# Altium schematic sheet pca63100_current_automatic_switch.SchDoc: Power Profiler Kit II
size A3; Organization: Nordic Semiconductor; Revision: 1.0.1; SheetNumber: 5; SheetTotal: 6; CompanyName: Nordic Semiconductor; DocumentSize: A3
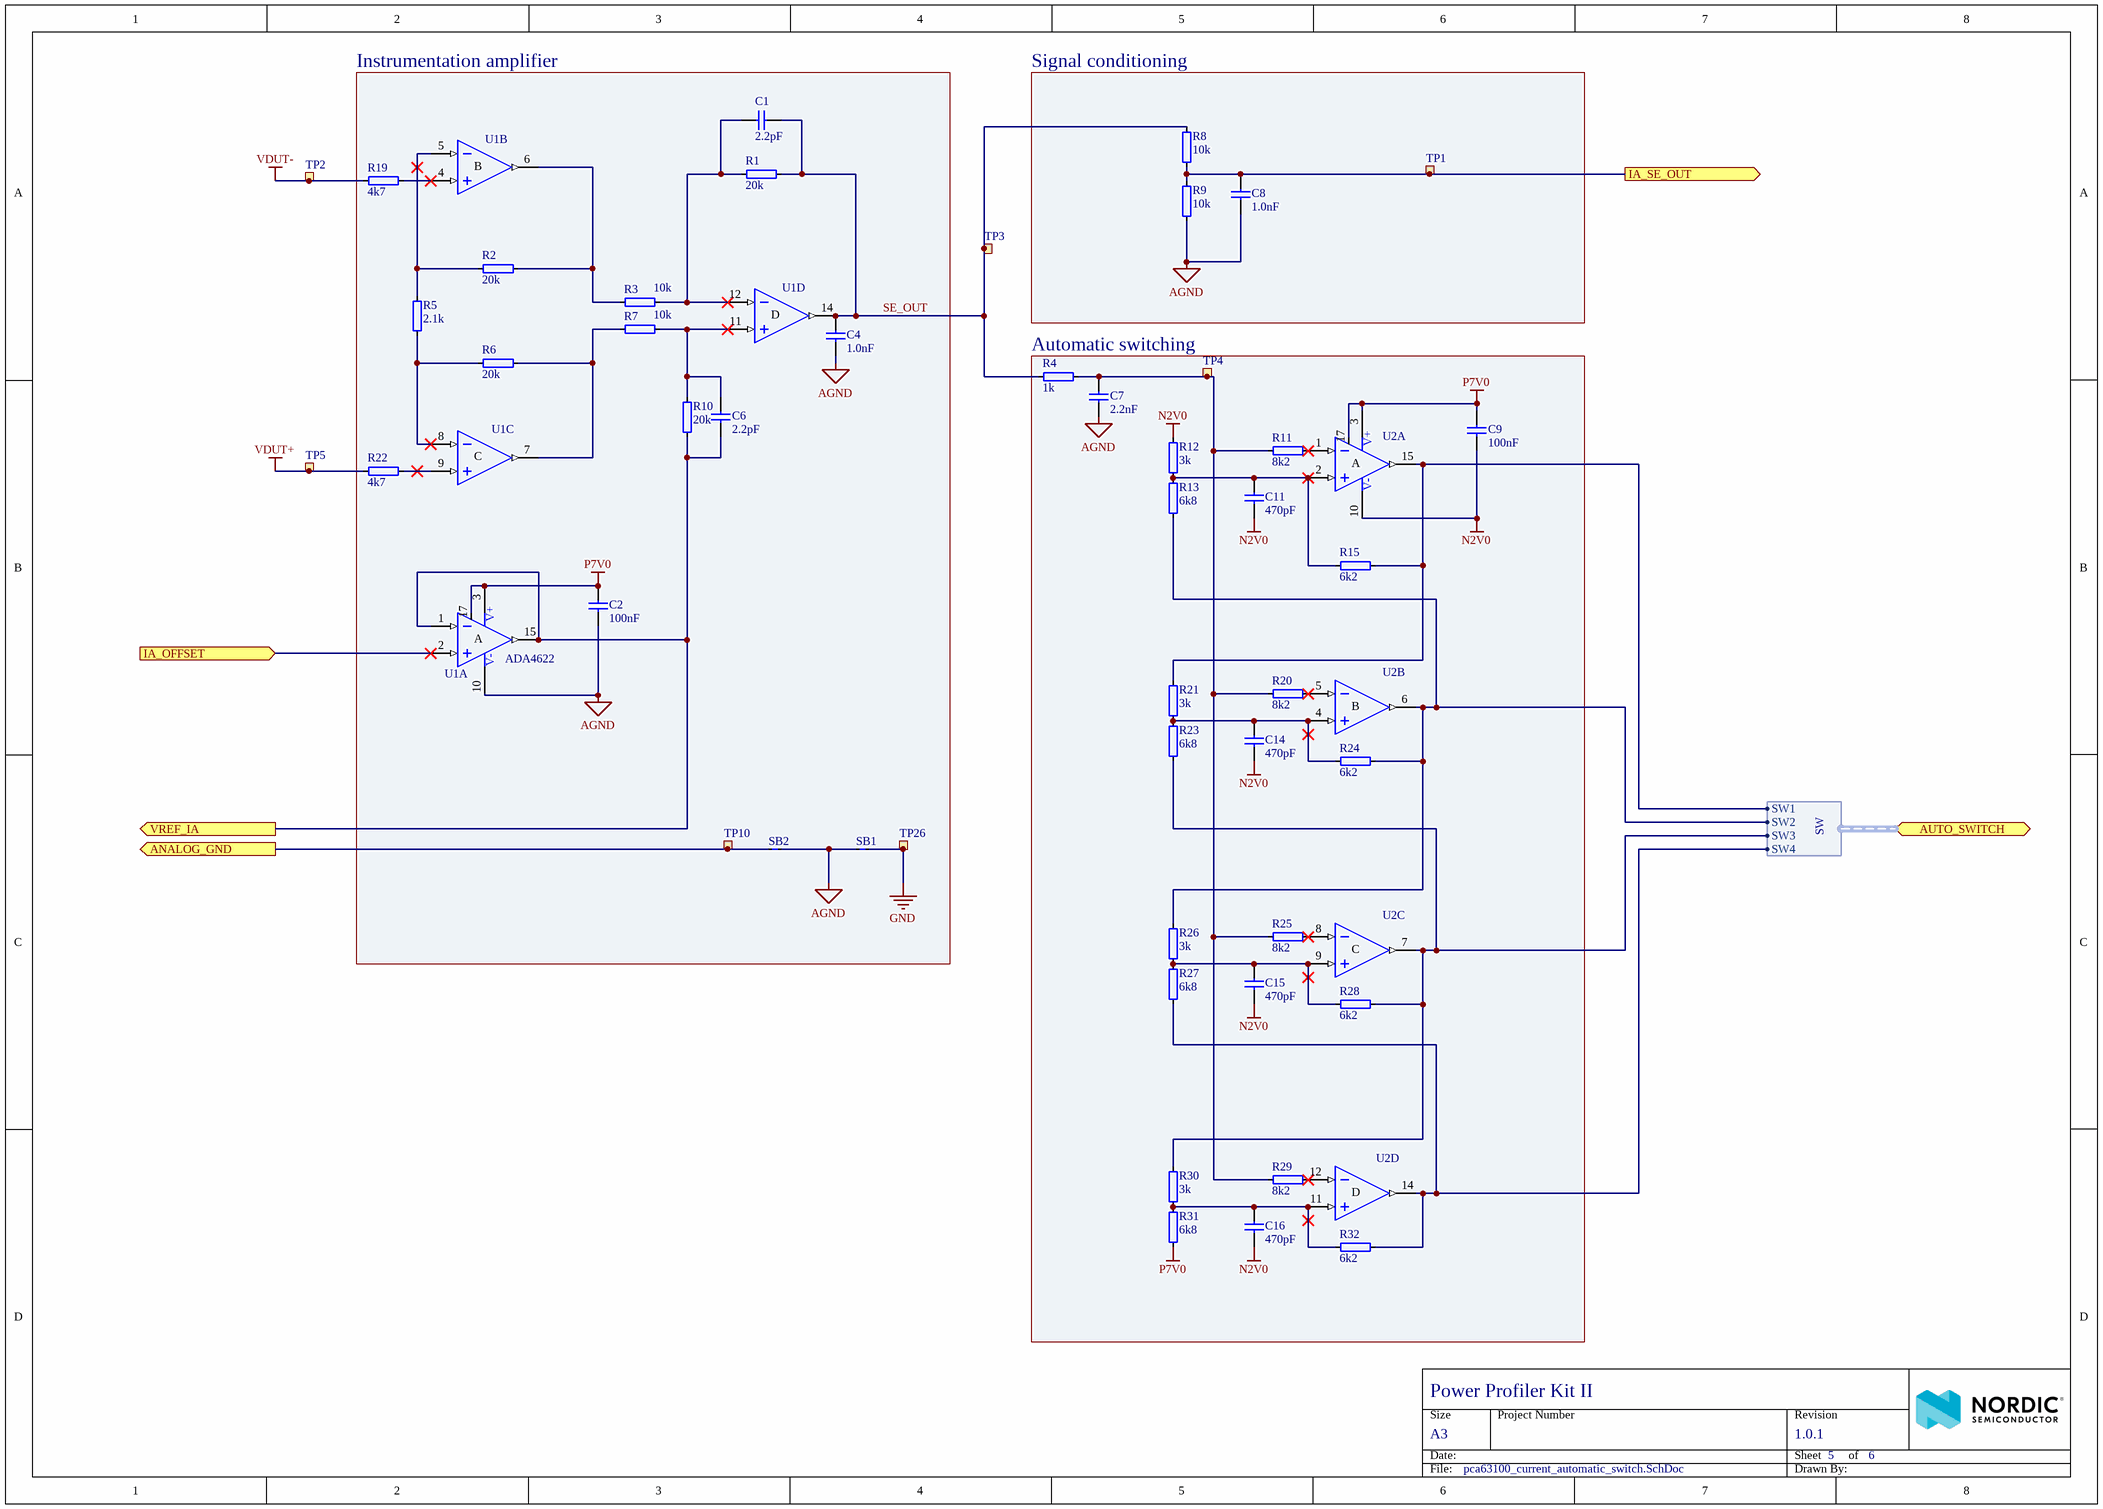
[diagram p0: pca63100_current_automatic_switch.SchDoc]

## Parts
C1  2.2pF  [CAPC0603X03L_C]
C2  100nF  [CAPC0603X03L_C]
C4  1.0nF  [CAPC0603X03L_C]
C6  2.2pF  [CAPC0603X03L_C]
C7  2.2nF  [CAPC0603X03L_C]
C8  1.0nF  [CAPC0603X03L_C]
C9  100nF  [CAPC0603X03L_C]
C11  470pF  [CAPC0603X03L_C]
C14  470pF  [CAPC0603X03L_C]
C15  470pF  [CAPC0603X03L_C]
C16  470pF  [CAPC0603X03L_C]
R1  20k  [RESC0603X03L_C]
R2  20k  [RESC0603X03L_C]
R3  10k  [RESC0603X03L_C]
R4  1k  [RESC0603X03L_C]
R5  2.1k  [RESC0603X03L_C]
R6  20k  [RESC0603X03L_C]
R7  10k  [RESC0603X03L_C]
R8  10k  [RESC0603X03L_C]
R9  10k  [RESC0603X03L_C]
R10  20k  [RESC0603X03L_C]
R11  8k2  [RESC0603X03L_C]
R12  3k  [RESC0603X03L_C]
R13  6k8  [RESC0603X03L_C]
R15  6k2  [RESC0603X03L_C]
R19  4k7  [RESC0603X03L_C]
R20  8k2  [RESC0603X03L_C]
R21  3k  [RESC0603X03L_C]
R22  4k7  [RESC0603X03L_C]
R23  6k8  [RESC0603X03L_C]
R24  6k2  [RESC0603X03L_C]
R25  8k2  [RESC0603X03L_C]
R26  3k  [RESC0603X03L_C]
R27  6k8  [RESC0603X03L_C]
R28  6k2  [RESC0603X03L_C]
R29  8k2  [RESC0603X03L_C]
R30  3k  [RESC0603X03L_C]
R31  6k8  [RESC0603X03L_C]
R32  6k2  [RESC0603X03L_C]
SB1  NetTie_200um  [NetTie_200um]  (value not drawn)  (net tie, no BOM)
SB2  NetTie_200um  [NetTie_200um]  (value not drawn)  (net tie, no BOM)
TP1  Ø0.7mm,SMD  [TP_SMD_Ø0.7mm]  (value not drawn)  (no BOM)
TP2  Ø0.7mm,SMD  [TP_SMD_Ø0.7mm]  (value not drawn)  (no BOM)
TP3  Ø0.7mm,SMD  [TP_SMD_Ø0.7mm]  (value not drawn)  (no BOM)
TP4  Ø0.7mm,SMD  [TP_SMD_Ø0.7mm]  (value not drawn)  (no BOM)
TP5  Ø0.7mm,SMD  [TP_SMD_Ø0.7mm]  (value not drawn)  (no BOM)
TP10  Ø0.7mm,SMD  [TP_SMD_Ø0.7mm]  (value not drawn)  (no BOM)
TP26  Ø0.7mm,SMD  [TP_SMD_Ø0.7mm]  (value not drawn)  (no BOM)
U1  ADA4622  [QFN65P400X400X80_HS-17N]  (parts A,B,C,D of 4)
U2  ADA4622  [QFN65P400X400X80_HS-17N]  (value not drawn)  (parts A,B,C,D of 4)

## Blocks framed on the sheet
Instrumentation amplifier: C1 C2 C4 C6 R1-R3 R5-R7 R10 R19 R22 SB1 SB2 TP10 TP26 U1
Signal conditioning: C8 R8 R9 TP1
Automatic switching: C7 C9 C11 C14-C16 R4 R11-R13 R15 R20 R21 R23-R32 TP4 U2

## Ports
ANALOG_GND (out), AUTO_SWITCH (bidir, harness SW), IA_OFFSET (in), IA_SE_OUT (out), VREF_IA (out)

## Harnesses
SW: SW1, SW2, SW3, SW4

## Nets
AGND: C2.2 C4.1 C7.1 C8.1 R9.1 SB1.1 SB2.2 U1.10(VSS)
GND: SB1.2 TP26.1
N2V0: C9.1 C11.1 C14.1 C15.1 C16.1 R12.2 U2.10(VSS)
P7V0: C2.1 C9.2 R31.1 U1.3(VDD) U1.17(EPAD) U2.3(VDD) U2.17(EPAD)
VDUT+: R22.2 TP5.1
VDUT-: R19.2 TP2.1
ANALOG_GND: SB2.1 TP10.1 ; port ANALOG_GND
IA_OFFSET: U1.2(IN_A+) ; port IA_OFFSET
IA_SE_OUT: C8.2 R8.2 R9.2 TP1.1 ; port IA_SE_OUT
SE_OUT: C1.2 C4.2 R1.2 R4.1 R8.1 TP3.1 U1.14(OUTD)
VREF_IA: C6.1 R10.1 U1.1(IN_A-) U1.15(OUTA) ; port VREF_IA
NetC1_1: C1.1 R1.1 R3.2 U1.12(IN_D-)
NetC6_2: C6.2 R7.2 R10.2 U1.11(IN_D+)
NetC7_2: C7.2 R4.2 R11.1 R20.1 R25.1 R29.1 TP4.1
NetC11_2: C11.2 R12.1 R13.2 R15.1 U2.2(IN_A+)
NetC14_2: C14.2 R21.1 R23.2 R24.1 U2.4(IN_B+)
NetC15_2: C15.2 R26.1 R27.2 R28.1 U2.9(IN_C+)
NetC16_2: C16.2 R30.1 R31.2 R32.1 U2.11(IN_D+)
NetR2_1: R2.1 R5.2 U1.5(IN_B-)
NetR2_2: R2.2 R3.1 U1.6(OUTB)
NetR5_1: R5.1 R6.1 U1.8(IN_C-)
NetR6_2: R6.2 R7.1 U1.7(OUTC)
NetR11_2: R11.2 U2.1(IN_A-)
NetR13_1: R13.1 R24.2 R26.2 U2.6(OUTB) ; port AUTO_SWITCH.SW2
NetR15_2: R15.2 R21.2 U2.15(OUTA) ; port AUTO_SWITCH.SW1
NetR19_1: R19.1 U1.4(IN_B+)
NetR20_2: R20.2 U2.5(IN_B-)
NetR22_1: R22.1 U1.9(IN_C+)
NetR23_1: R23.1 R28.2 R30.2 U2.7(OUTC) ; port AUTO_SWITCH.SW3
NetR25_2: R25.2 U2.8(IN_C-)
NetR27_1: R27.1 R32.2 U2.14(OUTD) ; port AUTO_SWITCH.SW4
NetR29_2: R29.2 U2.12(IN_D-)

Not connected (* = marked no-connect by the designer): U1 13(NIC) 16(NIC); U2 13(NIC) 16(NIC)

## Notes on the sheet
- Size
- Date:
- A3
- Project Number
- Sheet         of
- Revision
- File:
- Drawn By:
- (in symbol ADA4622-4, part A) V+; A; V-
- (in symbol ADA4622-4, part B) B
- (in symbol ADA4622-4, part C) C
- (in symbol ADA4622-4, part D) D

## Library data of the parts
C1 C6 = C0201-2.2p: Chip Cap 0201; Note: Chip Cap 1%; Artikkelnr Noca: N.A.; Pad Count: 2; Part Number: C0201-2.2p; ComponentLink1Description: Datasheet; ComponentLink2Description: Supplier link; Footprint Doc: 0201; LatestRevisionDate: 2014-11-13; Pin Count: 2; Publisher: Nordic Semiconductor; Published: 2014-11-13; Value: 2.2pF; Part number IPS: N.A.; Component Class: Capacitors; PartId: 100200020
C2 C9 = C0201-100n: Capacitor, X5R, ±10%; Part number IPS: 00000001248, 00000002505; Note: 16V; Artikkelnr Noca: N.A.; Pad Count: 2; Part Number: C0201-100n; Footprint Doc: 0201; LatestRevisionDate: 2017-11-09; Pin Count: 2; Publisher: Nordic Semiconductor; Published: 2014-11-13; Value: 100nF; ComponentLink1Description: Datasheet; ComponentLink2Description: Supplier link; Component Class: Capacitors; PartId: 100200078
C4 C8 = C0201-1n0: Capacitor, X7R, ±10%; Part number IPS: 00000003206; Note: 16V; Artikkelnr Noca: N.A.; Pad Count: 2; Part Number: C0201-1n0; ComponentLink1Description: Datasheet; ComponentLink2Description: Supplier link; Footprint Doc: 0201; LatestRevisionDate: 2020-10-13; Pin Count: 2; Publisher: Nordic Semiconductor; Published: 2014-11-13; Value: 1.0nF; Component Class: Capacitors; PartId: 100200056
C7 = C0201-2n2: Capacitor, X7R, ±10%, 10V; Part number IPS: 00000001778; Artikkelnr Noca: N.A.; Pad Count: 2; Part Number: C0201-2n2; ComponentLink1Description: Datasheet; ComponentLink2Description: Supplier link; Footprint Doc: 0201; LatestRevisionDate: 2014-11-13; Pin Count: 2; Publisher: Nordic Semiconductor; Published: 2014-11-13; Value: 2.2nF; Note: 10V; Component Class: Capacitors; PartId: 100200060
C11 C14-C16 = C0201-470p: Chip Cap 0201; Part number IPS: 00000005775; Note: Chip Cap 1%; Artikkelnr Noca: N.A.; Pad Count: 2; Part Number: C0201-470p; ComponentLink1Description: Datasheet; ComponentLink2Description: Supplier link; Footprint Doc: 0201; LatestRevisionDate: 2020-10-13; Publisher: Nordic Semiconductor; Published: 2014-11-13; Value: 470pF; Component Class: Capacitors; PartId: 100200052
  C11 C14: Pin Count: 2
R1 R2 R6 R10 = R0201-20k_0.1%: Resistor, ±0.1%, 0.031W; Part number IPS: 00000004785; Note: Chip Res 0.1%; Artikkelnr Noca: N.A.; Pad Count: 2; Part Number: R0201-20k_0.1%; ComponentLink1Description: Datasheet; ComponentLink2Description: Supplier link; Footprint Doc: 0201; LatestRevisionDate: 2019-10-07; Pin Count: 2; Publisher: Nordic Semiconductor; Published: 2019-10-07; Value: 20k; Component Class: Resistors; PartId: 100100598
R3 R7-R9 = R0201-10k_0.1%: Resistor, ±0.1%, 0.031W; Part number IPS: 00000004786; Note: Chip Res 0.1%; Artikkelnr Noca: N.A.; Pad Count: 2; Part Number: R0201-10k_0.1%; ComponentLink1Description: Datasheet; ComponentLink2Description: Supplier link; Footprint Doc: 0201; LatestRevisionDate: 2019-10-07; Pin Count: 2; Publisher: Nordic Semiconductor; Published: 2019-10-07; Value: 10k; Component Class: Resistors; PartId: 100100597
R4 = R0201-1k0: Resistor, ±1%, 0.05W; Part number IPS: 00000005786; Note: Chip Res 1%; Artikkelnr Noca: N.A.; Pad Count: 2; Part Number: R0201-1k0; ComponentLink1Description: Datasheet; ComponentLink2Description: Supplier link; Footprint Doc: 0201; LatestRevisionDate: 2014-11-13; Publisher: Nordic Semiconductor; Published: 2014-11-13; Value: 1k; Component Class: Resistors; PartId: 100100043
R5 = R0201-2k1: RES SMD 2.1K OHM 1% 1/20W 0201; Manufacturer: Panasonic; Manufacturer Part Number: ERJ-1GEF2101C; Part number IPS: 00000004787; Note: Chip Res 1%; Artikkelnr Noca: N.A.; Pad Count: 2; Part Number: R0201-2k1; ComponentLink1Description: Datasheet; ComponentLink2Description: Supplier link; HelpURL: http://media.digikey.com/pdf/Data%20Sheets/Panasonic%20Resistors%20Thermistors%20PDFs/ERJ_G,R,E_Rev08.pdf; Footprint Doc: 0201; LatestRevisionDate: 2017-02-13; Pin Count: 2; Publisher: Nordic Semiconductor; Published: 2017-02-13; Value: 2.1k; Supplier 1: Digi-Key; Supplier Part Number 1: P2.10KABCT-ND; Component Class: Resistors; PartId: 100100573
R11 R15 R20 R24 R25 R28 R29 = R0201-8k2: Resistor, ±1%, 0.05W; Part number IPS: 00000004788; Note: Chip Res 1%; Artikkelnr Noca: N.A.; Pad Count: 2; Part Number: R0201-8k2; ComponentLink1Description: Datasheet; ComponentLink2Description: Supplier link; Footprint Doc: 0201; LatestRevisionDate: 2014-11-13; Pin Count: 2; Publisher: Nordic Semiconductor; Published: 2014-11-13; Component Class: Resistors; PartId: 100100064
  R11 R20 R25 R29: Value: 8k2
  R15 R24 R28: Value: 6k2
R12 R21 R26 R30 = R0201-3k0: Resistor, ±1%, 0.05W; Part number IPS: 00000001688; Note: Chip Res 1%; Artikkelnr Noca: N.A.; Pad Count: 2; Part Number: R0201-3k0; ComponentLink1Description: Datasheet; ComponentLink2Description: Supplier link; Footprint Doc: 0201; LatestRevisionDate: 2014-11-13; Pin Count: 2; Publisher: Nordic Semiconductor; Published: 2014-11-13; Value: 3k; Component Class: Resistors; PartId: 100100056
R13 R23 R27 R31 R32 = R0201-6k8: Resistor, ±1%, 0.05W; Part number IPS: 00000001705; Note: Chip Res 1%; Artikkelnr Noca: N.A.; Pad Count: 2; Part Number: R0201-6k8; ComponentLink1Description: Datasheet; ComponentLink2Description: Supplier link; Footprint Doc: 0201; LatestRevisionDate: 2014-11-13; Pin Count: 2; Publisher: Nordic Semiconductor; Published: 2014-11-13; Component Class: Resistors; PartId: 100100063
  R13 R23 R27 R31: Value: 6k8
  R32: Value: 6k2
R19 R22 = R0201-4k7: Resistor, ±1%, 0.05W; Part number IPS: 00000001706; Note: Chip Res 1%; Artikkelnr Noca: N.A.; Pad Count: 2; Part Number: R0201-4k7; ComponentLink1Description: Datasheet; ComponentLink2Description: Supplier link; Footprint Doc: 0201; LatestRevisionDate: 2014-11-13; Pin Count: 2; Publisher: Nordic Semiconductor; Published: 2014-11-13; Value: 4k7; Component Class: Resistors; PartId: 100100061
SB1 SB2 = NetTie 0.2mm: Net Tie; Artikkelnr Noca: N.A.; Pad Count: 2; Part Number: NetTie 0.2mm; ComponentLink1Description: Datasheet; ComponentLink2Description: Supplier link; Footprint Doc: NetTie; LatestRevisionDate: 2019-10-07; Pin Count: 2; Publisher: Nordic Semiconductor; Published: 2019-10-07; Value: NetTie_200um; Part number IPS: N.A.; Component Class: Connectors; PartId: 100500654
TP1-TP5 TP10 TP26 = TP_SMD_Ø0.7MM: 0.7mm circular SMD testpad; Manufacturer: Nordic Semiconductor; Artikkelnr Noca: N.A.; Pad Count: 1; Part Number: TP_SMD_Ø0.7MM; ComponentLink1Description: Datasheet; ComponentLink2Description: Supplier link; Footprint Doc: TP_SMD_Ø0.7mm; LatestRevisionDate: 2017-12-14; Pin Count: 1; Publisher: Nordic Semiconductor; Published: 2017-12-14; Value: Ø0.7mm,SMD; Part number IPS: N.A.; Component Class: Connectors; PartId: 100500474
U1 U2 = ADA4622-4: J-FET Amplifier 4 Circuit Rail-to-Rail 16-LFCSP (4x4); Manufacturer: Analog Devices; Manufacturer Part Number: ADA4622-4ACPZ-RL; Part number IPS: 00000004963; Artikkelnr Noca: N.A.; Pad Count: 17; Part Number: ADA4622-4; ComponentLink1URL: https://www.analog.com/media/en/technical-documentation/data-sheets/ada4622-1-4622-2-4622-4.pdf; ComponentLink1Description: Datasheet; ComponentLink2URL: https://www.digikey.no/product-detail/en/analog-devices-inc/ADA4622-4ACPZ-RL/ADA4622-4ACPZ-RL-ND/6490586; ComponentLink2Description: Supplier link; HelpURL: https://www.analog.com/en/products/ada4622-4.html; Footprint Doc: QFN-16; LatestRevisionDate: 2019-06-19; Pin Count: 17; Publisher: Nordic Semiconductor; Published: 2019-06-19; Value: ADA4622; Supplier 1: Digi-Key; Supplier Part Number 1: ADA4622-4ACPZ-R7-ND; Supplier 2: Mouser; Supplier Part Number 2: 584-ADA4622-4ACPZ-R7; Component Class: Misc_ICs; PartId: 101900585